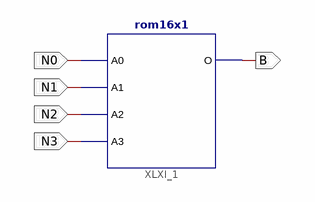
[diagram p0: schematic sheet 1]
// Xilinx ISE schematic rom_b.sch (spartan3e) as structural Verilog: 1 symbols, 5 ports
module rom_b (
  input  N0,
  input  N2,
  input  N3,
  input  N1,
  output B
);

  rom16x1 #(.INIT("D860")) XLXI_1 (.A0(N0), .A1(N1), .A2(N2), .A3(N3), .O(B));
endmodule
